# EasyEDA Pro project SquimeVR-V3S.epro

# Schematic Schematic-Tracker-v3-S
Create Date: 2024-03-23; Page Name: P1; Project Name: SquimeVR-V3S; Schematic Name: Schematic-Tracker-v3-S; Update Date: 2024-03-23; Company: 嘉立创EDA; Page Size: A4; Version: V1.0
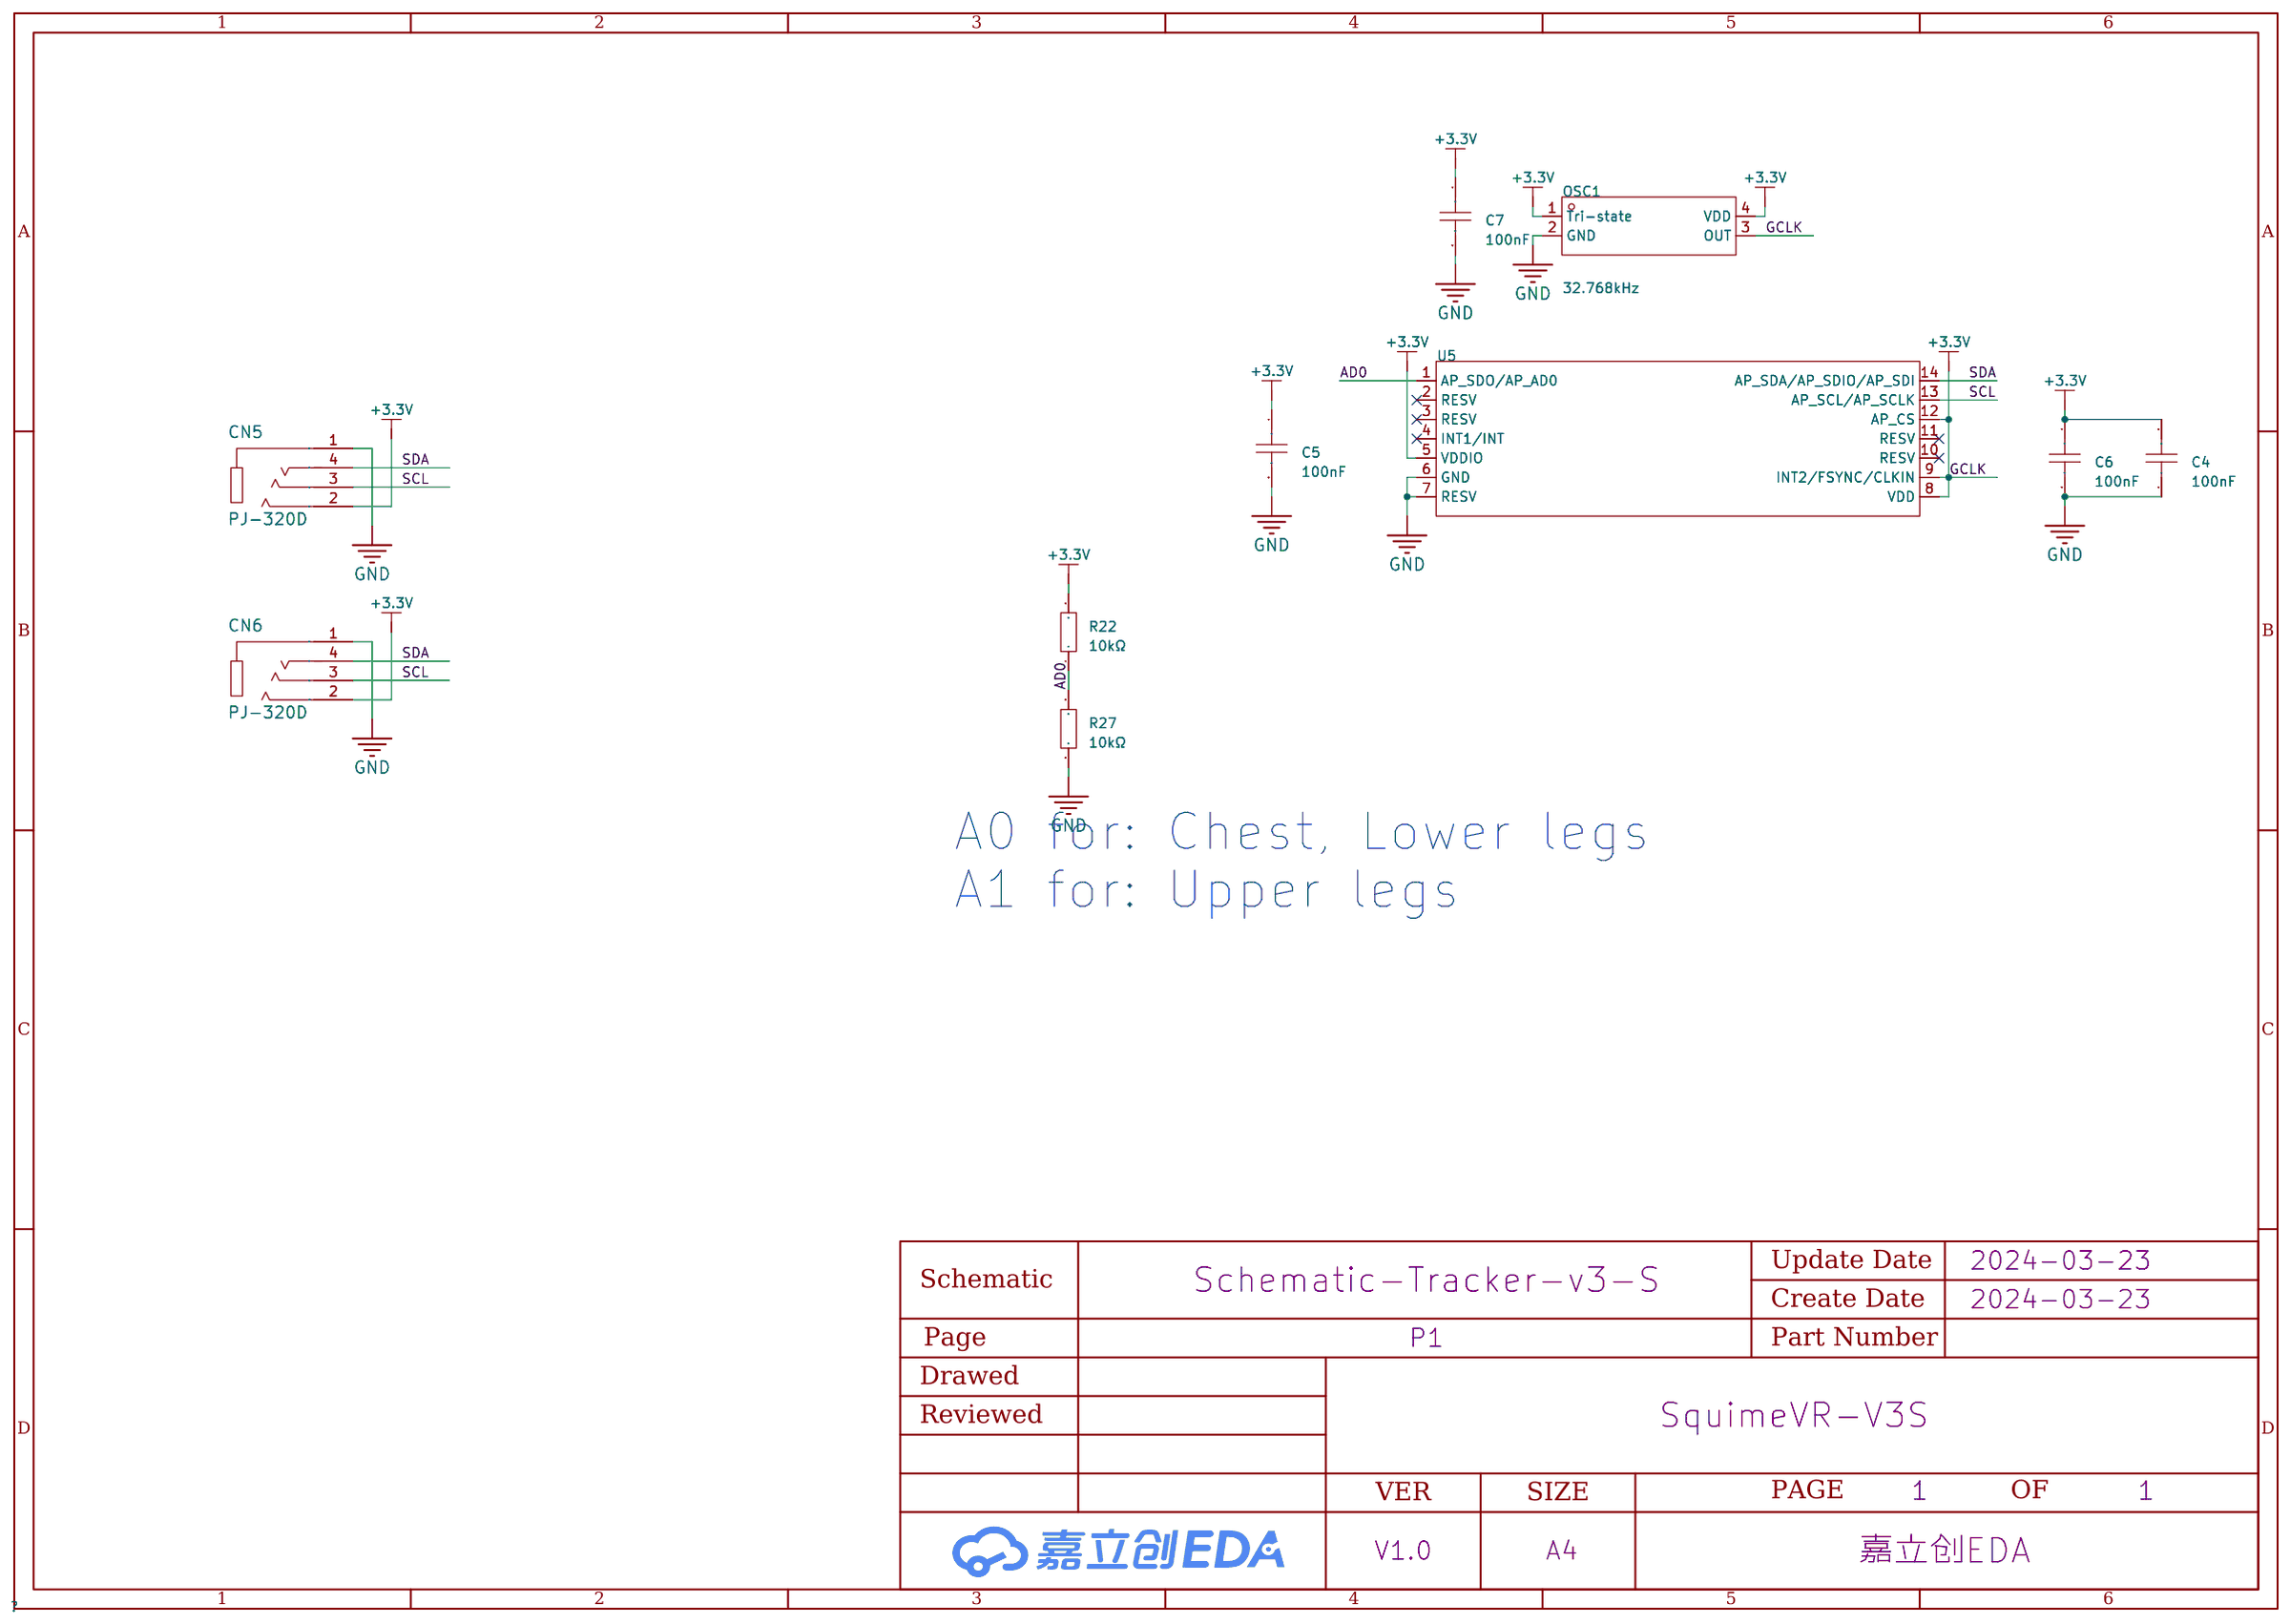
[diagram p0: schematic sheet]

## Parts
C4  100nF  [C0603]
C5  100nF  [C0603]
C6  100nF  [C0603]
C7  100nF  [C0603]
CN5  PJ-320D  [AUDIO-SMD_PJ-320D]
CN6  PJ-320D  [AUDIO-SMD_PJ-320D]
OSC1  32.768kHz  [OSC-SMD_4P-L3.2-W2.5-BL]
R22  10kΩ  [R0603]
R27  10kΩ  [R0603]
U5  ICM-42688-P  [LGA-14_L3.0-W2.5-P0.50-TL]

## Library data of the parts
C4-C7 = CC0603KRX7R9BB104: 容值:100nF;精度:±10%;额定电压:50V;材质(温度系数):X7R;; LCSC Part Name: 100nF ±10% 50V; Supplier Part: C14663; Manufacturer: YAGEO(国巨); Supplier Footprint: 0603; JLCPCB Part Class: Basic Part; Datasheet: https://atta.szlcsc.com/upload/public/pdf/source/20180910/C282072_33301C7F631E79921B82A8DAC6BCC5B3.pdf; Supplier: LCSC; Tolerance: ±10%; Voltage Rated: 50V; Temperature Coefficient: X7R
CN5 CN6 = PJ-320D: Supplier: LCSC; Supplier Part: C431535; Manufacturer: SHOUHAN; JLCPCB Part Class: ExtendedPart
OSC1 = OK2EL89CJI-111YLC-32.768K: 频率:32.768kHz;常温频差:±10ppm;工作电压:1.8V~3.3V;; LCSC Part Name: 32.768KHZ 1.8V-3.3V ±10PPM YSO120TK; Supplier Part: C5280579; Manufacturer: YXC(扬兴晶振); Supplier Footprint: SMD3225-4P; JLCPCB Part Class: Extended Part; Datasheet: https://atta.szlcsc.com/upload/public/pdf/source/20221123/314DEFB66F8D0824EF78ADB5B539B6E4.pdf; Supplier: LCSC; Normal temperature Frequency Tolerance: ±10ppm; Supply Voltage: 1.8V~3.3V
R22 R27 = 0603WAF1001T5E: 电阻类型:厚膜电阻;阻值:1kΩ;精度:±1%;功率:100mW;; LCSC Part Name: 1kΩ ±1% 100mW; Supplier Part: C21190; Manufacturer: UNI-ROYAL(厚声); Supplier Footprint: 0603; JLCPCB Part Class: Basic Part; Datasheet: https://atta.szlcsc.com/upload/public/pdf/source/20200306/C422600_1E6D84923E4A46A82E41ADD87F860B5C.pdf; Supplier: LCSC; Type: 厚膜电阻; Tolerance: ±1%; Power(Watts): 100mW; Temperature Coefficient: ±100ppm/℃; Overload Voltage (Max): 75V; Operating Temperature Range: -55℃~+155℃
U5 = ICM-42688-P: 传感器类型:加速度计陀螺仪;; Supplier Part: C1850418; Manufacturer: TDK InvenSense(应美盛); Supplier Footprint: LGA-14(2.5x3); JLCPCB Part Class: 扩展库; Datasheet: https://atta.szlcsc.com/upload/public/pdf/source/20210703/CF24204867ACE5B754A2B035F23E5931.pdf; Supplier: LCSC; Sensor Type: 加速度计陀螺仪

## Nets
+3.3V: C4.2 C5.1 C6.1 C7.1 CN5.2 CN6.2 OSC1.1(Tri-state) OSC1.4(VDD) R22.2 U5.5(VDDIO) U5.8(VDD) U5.12(AP_CS)
GND: C4.1 C5.2 C6.2 C7.2 CN5.1 CN6.1 OSC1.2(GND) R27.1 U5.6(GND) U5.7(RESV)
AD0: R22.1 R27.2 U5.1(AP_SDO/AP_AD0)
GCLK: OSC1.3(OUT) U5.9(INT2/FSYNC/CLKIN)
SCL: CN5.3 CN6.3 U5.13(AP_SCL/AP_SCLK)
SDA: CN5.4 CN6.4 U5.14(AP_SDA/AP_SDIO/AP_SDI)

Not connected (* = marked no-connect by the designer): U5 2(RESV)* 3(RESV)* 4(INT1/INT)* 10(RESV)* 11(RESV)*

## Notes on the sheet
- A0 for: Chest, Lower legs
  A1 for: Upper legs

# Schematic Schematic-Core-v3-S
Create Date: 2024-03-23; Page Name: P1; Project Name: SquimeVR-V3S; Schematic Name: Schematic-Core-v3-S; Update Date: 2024-03-23; Company: 嘉立创EDA; Page Size: A4; Version: V1.0
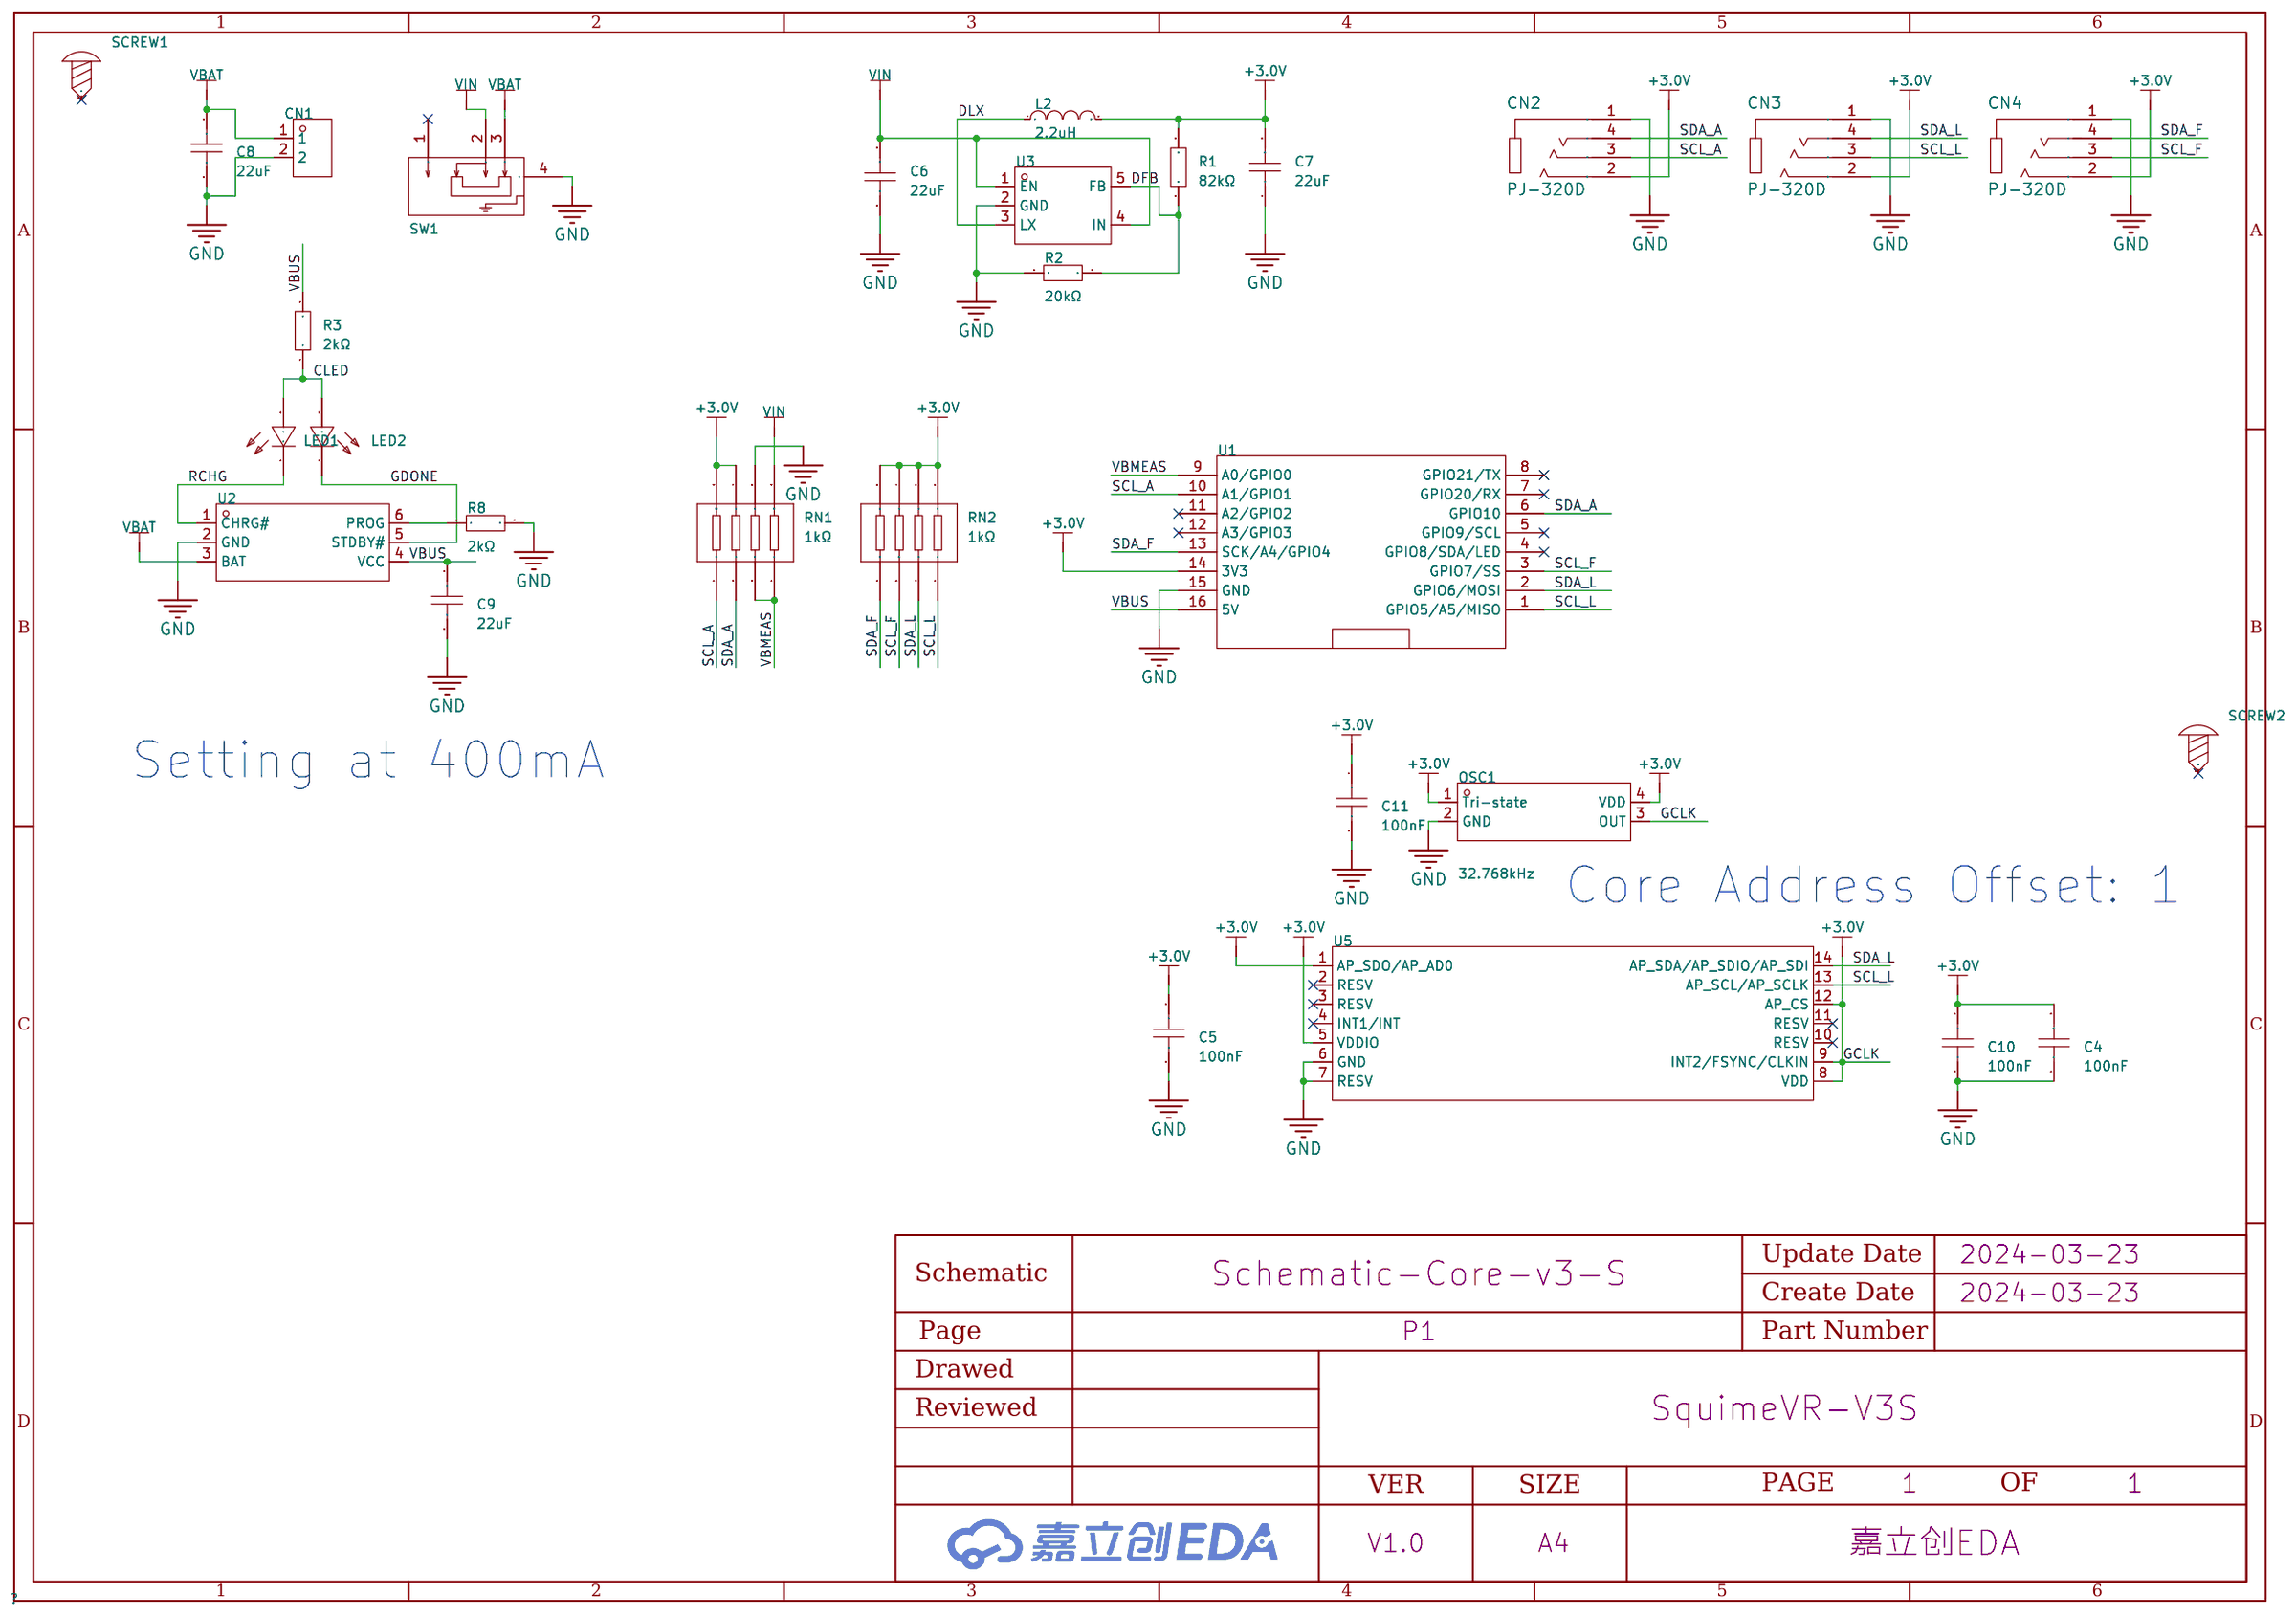
[diagram p1: schematic sheet]

## Parts
C4  100nF  [C0603]
C5  100nF  [C0603]
C6  22uF  [C0603]
C7  22uF  [C0603]
C8  22uF  [C0603]
C9  22uF  [C0603]
C10  100nF  [C0603]
C11  100nF  [C0603]
CN1  2.0-1*2P母  [HDR-TH_2P-P2.00-V-F-1]
CN2  PJ-320D  [AUDIO-SMD_PJ-320D]
CN3  PJ-320D  [AUDIO-SMD_PJ-320D]
CN4  PJ-320D  [AUDIO-SMD_PJ-320D]
L2  2.2uH  [IND-SMD_L2.5-W2.0-VLS252012CX-150M]
LED1  NCD0603R1  [LED0603-RD_RED]
LED2  NCD0603G1  [LED0603-RD]
OSC1  32.768kHz  [OSC-SMD_4P-L3.2-W2.5-BL]
R1  82kΩ  [R0603]
R2  20kΩ  [R0603]
R3  2kΩ  [R0603]
R8  2kΩ  [R0603]
RN1  1kΩ  [RES-ARRAY-SMD_0603-8P-L3.2-W1.6-BL]
RN2  1kΩ  [RES-ARRAY-SMD_0603-8P-L3.2-W1.6-BL]
SCREW1  -  [M2螺丝]
SCREW2  -  [M2螺丝]
SW1  MSK12C02  [SW-TH_MSK12C02]
U1  -  [SMD_ESP32C3SuperMini]
U2  TP4057  [SOT-23-6_L2.9-W1.6-P0.95-LS2.8-BR]
U3  M3406-ADJ  [SOT-23-5_L3.0-W1.7-P0.95-LS2.8-BR]
U5  ICM-42688-P  [LGA-14_L3.0-W2.5-P0.50-TL]

## Library data of the parts
C4 C5 C10 C11 = CC0603KRX7R9BB104: 容值:100nF;精度:±10%;额定电压:50V;材质(温度系数):X7R;; LCSC Part Name: 100nF ±10% 50V; Supplier Part: C14663; Manufacturer: YAGEO(国巨); Supplier Footprint: 0603; JLCPCB Part Class: Basic Part; Datasheet: https://atta.szlcsc.com/upload/public/pdf/source/20180910/C282072_33301C7F631E79921B82A8DAC6BCC5B3.pdf; Supplier: LCSC; Tolerance: ±10%; Voltage Rated: 50V; Temperature Coefficient: X7R
C6-C9 = CL10A226MQ8NRNC: 容值:22uF;精度:±20%;额定电压:6.3V;材质(温度系数):X5R;; LCSC Part Name: 22uF ±20% 6.3V; Supplier Part: C59461; Manufacturer: SAMSUNG(三星); Supplier Footprint: 0603; JLCPCB Part Class: Basic Part; Datasheet: https://atta.szlcsc.com/upload/public/pdf/source/20160103/1457707740762.pdf; Supplier: LCSC; Tolerance: ±20%; Voltage Rated: 6.3V; Temperature Coefficient: X5R
CN1 = 2.0-1*2P母: 间距:2mm;行距:-;安装类型:直插;排数:单排;总孔位数:2P;塑高:-;触头材质:-;触头镀层:-;; LCSC Part Name: 间距:2mm 直插; Supplier Part: C66509; Manufacturer: BOOMELE(博穆精密); Supplier Footprint: 插件,P=2mm; JLCPCB Part Class: Extended Part; Datasheet: https://atta.szlcsc.com/upload/public/pdf/source/20231221/2754FEDF6E505219A1427F9D46FAAD3C.pdf; Supplier: LCSC; Pitch: 2mm; Mounting Type: 直插; Number of Rows: 单排; Number of Holes: 2P; Pins Structure: 1x2P; Mounting Style: 直插; Reference Series: XH; Number of Pins: 2P; Number of PINs Per Row: 2; Current Rating (Max): 3A; Operating Temperature Range: -25℃~+85℃
CN2-CN4 = PJ-320D: Supplier: LCSC; Supplier Part: C431535; Manufacturer: SHOUHAN; JLCPCB Part Class: ExtendedPart
L2 = FXLB252012-2R2-M: 电感值:2.2uH;精度:±20%;额定电流:3A;饱和电流(Isat):3.3A;类型:一体成型电感;; LCSC Part Name: 2.2uH ±20% 3.3A; Supplier Part: C3040393; Manufacturer: cjiang(长江微电); Supplier Footprint: SMD,2.5x2.0x1.2mm; JLCPCB Part Class: Extended Part; Datasheet: https://atta.szlcsc.com/upload/public/pdf/source/20220812/975CD70F8F8BB72DF45FA36D37878048.pdf; Supplier: LCSC; Tolerance: ±20%; Rated Current: 3A; Saturation Current (Isat): 3.3A; DC Resistance (DCR): 68mΩ; Type: 一体成型电感; Ratings: AEC-Q200
LED1 = NCD0603R1_C84263: 灯头类型:-;发光颜色:红色;正向电压(VF):1.6V~2.6V;功率:65mW;正向电流:20mA;主波长:615nm~630nm;二极管配置:独立二极管;透镜颜色:无色透明透镜;色温:-;发光强度:80mcd~220mcd;发光角度:130°;载带方式:-;工作温度:-30℃~+85℃;; Supplier Part: C84263; Manufacturer: 国星光电; Supplier Footprint: 0603; Datasheet: https://atta.szlcsc.com/upload/public/pdf/source/20200820/C84263_DABC6A75E58F576973B407FDBA283D60.pdf; Supplier: LCSC; Emitted Color: 红色; Forward Voltage (VF): 1.6V~2.6V; Power Dissipation: 65mW; Forward Current: 20mA; Dominant Wavelength: 615nm~630nm; Diode Configuration: 独立二极管; Lens Color: 无色透明透镜; Luminous Intensity: 80mcd~220mcd; Viewing Angle: 130°; Operating Temperature: -30℃~+85℃
LED2 = NCD0603G1: 发光颜色:翠绿色;正向电压(VF):2.6V~3.6V;功率:72mW;正向电流:10mA;主波长:515nm~530nm;透镜颜色:无色透明透镜;发光强度:330mcd~900mcd;发光角度:130°;工作温度:-30℃~+85℃;; Supplier Part: C84267; Manufacturer: 国星光电; Supplier Footprint: 0603; JLCPCB Part Class: 扩展库; Datasheet: https://atta.szlcsc.com/upload/public/pdf/source/20200820/C84267_04BA7703640BAC111D09F5EFB971FBF3.pdf; Supplier: LCSC; Emitted Color: 翠绿色; Forward Voltage (VF): 2.6V~3.6V; Power Dissipation: 72mW; Forward Current: 10mA; Dominant Wavelength: 515nm~530nm; Lens Color: 无色透明透镜; Luminous Intensity: 330mcd~900mcd; Viewing Angle: 130°; Operating Temperature: -30℃~+85℃
OSC1 = OK2EL89CJI-111YLC-32.768K: 频率:32.768kHz;常温频差:±10ppm;工作电压:1.8V~3.3V;; LCSC Part Name: 32.768KHZ 1.8V-3.3V ±10PPM YSO120TK; Supplier Part: C5280579; Manufacturer: YXC(扬兴晶振); Supplier Footprint: SMD3225-4P; JLCPCB Part Class: Extended Part; Datasheet: https://atta.szlcsc.com/upload/public/pdf/source/20221123/314DEFB66F8D0824EF78ADB5B539B6E4.pdf; Supplier: LCSC; Normal temperature Frequency Tolerance: ±10ppm; Supply Voltage: 1.8V~3.3V
R1 = 0603WAF8202T5E: 电阻类型:厚膜电阻;阻值:82kΩ;精度:±1%;功率:100mW;最大工作电压:75V;温度系数:±100ppm/℃;; LCSC Part Name: 82kΩ ±1% 100mW 厚膜电阻; Supplier Part: C23254; Manufacturer: UNI-ROYAL(厚声); Supplier Footprint: 0603; JLCPCB Part Class: Basic Part; Datasheet: https://atta.szlcsc.com/upload/public/pdf/source/20200306/C422600_1E6D84923E4A46A82E41ADD87F860B5C.pdf; Supplier: LCSC; Type: 厚膜电阻; Tolerance: ±1%; Power(Watts): 100mW; Overload Voltage (Max): 75V; Temperature Coefficient: ±100ppm/℃; Operating Temperature Range: -55℃~+155℃
R2 = 0603WAF2002T5E: 电阻类型:厚膜电阻;阻值:20kΩ;精度:±1%;功率:100mW;最大工作电压:75V;温度系数:±100ppm/℃;; LCSC Part Name: 20kΩ ±1% 100mW 厚膜电阻; Supplier Part: C4184; Manufacturer: UNI-ROYAL(厚声); Supplier Footprint: 0603; JLCPCB Part Class: Basic Part; Datasheet: https://atta.szlcsc.com/upload/public/pdf/source/20200306/C422600_1E6D84923E4A46A82E41ADD87F860B5C.pdf; Supplier: LCSC; Type: 厚膜电阻; Tolerance: ±1%; Power(Watts): 100mW; Temperature Coefficient: ±100ppm/℃; Overload Voltage (Max): 75V; Operating Temperature Range: -55℃~+155℃
R3 R8 = 0603WAF2001T5E: 电阻类型:厚膜电阻;阻值:2kΩ;精度:±1%;功率:100mW;最大工作电压:75V;温度系数:±100ppm/℃;; LCSC Part Name: 2kΩ ±1% 100mW 厚膜电阻; Supplier Part: C22975; Manufacturer: UNI-ROYAL(厚声); Supplier Footprint: 0603; JLCPCB Part Class: 基础库; Datasheet: https://atta.szlcsc.com/upload/public/pdf/source/20200306/C422600_1E6D84923E4A46A82E41ADD87F860B5C.pdf; Supplier: LCSC; Type: 厚膜电阻; Tolerance: ±1%; Power(Watts): 100mW; Overload Voltage (Max): 75V; Temperature Coefficient: ±100ppm/℃; Operating Temperature Range: -55℃~+155℃
RN1 RN2 = 4D03WGJ0102T5E: 电阻器数:4;阻值:1kΩ;精度:±5%;单个元件功率:62.5mW;温度系数:±200ppm/℃;; LCSC Part Name: 1kΩ ±5%; Supplier Part: C20197; Manufacturer: UNI-ROYAL(厚声); Supplier Footprint: 0603x4; JLCPCB Part Class: Basic Part; Datasheet: https://atta.szlcsc.com/upload/public/pdf/source/20191224/C474318_2527498AE30E813171187CCD28401A71.pdf; Supplier: LCSC; Number of Resistors: 4; Tolerance: ±5%; Power(Watts): 62.5mW; Temperature Coefficient: ±200ppm/℃; Number of Pins: 8
SCREW1 SCREW2 = M2螺丝: Supplier Footprint: 插件
SW1 = MSK12C02: 电路结构:单刀双掷;安装方式:卧贴;开关颜色:-;额定电流(DC):50mA;额定电压(DC):12V;额定电流(AC):-;额定电压(AC):-;机械寿命:1万次;; LCSC Part Name: 两档侧拨贴片 7脚 滑动开关; Supplier Part: C431540; Manufacturer: SHOU HAN(首韩); Supplier Footprint: SMD; JLCPCB Part Class: Extended Part; Datasheet: https://atta.szlcsc.com/upload/public/pdf/source/20190925/C431540_89155AEF0758B9AD1B2D805F83FB12E3.pdf; Supplier: LCSC; Circuit: 单刀双掷; Pin Style: SMD接片; Switch Length: 8mm; Switch Width: 2.8mm; Switch Height: 1.4mm; Mounting Style: 卧贴; Current Rating (DC): 50mA; Voltage Rating (DC): 12V; Mechanical Life: 1万次; Operating Temperature: -20℃~+70℃
U1 = ESP32C3SuperMini: ESP32C3SuperMini迷你开发板; 尺寸: 22.52x18mm; Comment: https://www.nologo.tech/product/esp32/esp32c3SuperMini/esp32C3SuperMini.html
U2 = TP4057: 电源电压:6.5V;最大充电电流:500mA;电池类型:锂离子/聚合物;电池节数:1;; Supplier Part: C725791; Manufacturer: UMW(友台半导体); Supplier Footprint: SOT-23-6; JLCPCB Part Class: 扩展库; Datasheet: https://atta.szlcsc.com/upload/public/pdf/source/20231109/7FB39B0490CD1514A6792371FCA0BB30.pdf; Supplier: LCSC; Supply Voltage: 6.5V; Maximum Charge Current: 500mA; Type of Battery: 锂离子/聚合物; Number of Cells: 1; Operating Temperature: -40℃~+85℃
U3 = M3406-ADJ: 功能类型:降压型;输入电压:-;输出电流(最大值):-;; Supplier Part: C83224; Manufacturer: 西安航天民芯; Supplier Footprint: SOT-23-5; JLCPCB Part Class: Extended Part; Datasheet: https://atta.szlcsc.com/upload/public/pdf/source/20180301/C181743_15198944852831384030.pdf; Supplier: LCSC; Function: 降压型; Switch tube (built-in/external): 内置
U5 = ICM-42688-P: 传感器类型:加速度计陀螺仪;; Supplier Part: C1850418; Manufacturer: TDK InvenSense(应美盛); Supplier Footprint: LGA-14(2.5x3); JLCPCB Part Class: 扩展库; Datasheet: https://atta.szlcsc.com/upload/public/pdf/source/20210703/CF24204867ACE5B754A2B035F23E5931.pdf; Supplier: LCSC; Sensor Type: 加速度计陀螺仪

## Nets
+3.0V: C4.2 C5.1 C7.2 C10.1 C11.1 CN2.2 CN3.2 CN4.2 L2.2 OSC1.1(Tri-state) OSC1.4(VDD) R1.2 RN1.7 RN1.8 RN2.5 RN2.6 RN2.7 RN2.8 U1.14(3V3) U5.1(AP_SDO/AP_AD0) U5.5(VDDIO) U5.8(VDD) U5.12(AP_CS)
GND: C4.1 C5.2 C6.1 C7.1 C8.2 C9.2 C10.2 C11.2 CN1.2 CN2.1 CN3.1 CN4.1 OSC1.2(GND) R2.1 R8.1 RN1.6 SW1.4 U1.15(GND) U2.2(GND) U3.2(GND) U5.6(GND) U5.7(RESV)
VBAT: C8.1 CN1.1 SW1.3 U2.3(BAT)
VBUS: C9.1 R3.2 U1.16(5V) U2.4(VCC)
VIN: C6.2 RN1.5 SW1.2 U3.1(EN) U3.4(IN)
CLED: LED1.2(A) LED2.2(A) R3.1
DFB: R1.1 R2.2 U3.5(FB)
DLX: L2.1 U3.3(LX)
GCLK: OSC1.3(OUT) U5.9(INT2/FSYNC/CLKIN)
GDONE: LED2.1(K) U2.5(STDBY#)
RCHG: LED1.1(K) U2.1(CHRG#)
SCL_A: CN2.3 RN1.1 U1.10(A1/GPIO1)
SCL_F: CN4.3 RN2.2 U1.3(GPIO7/SS)
SCL_L: CN3.3 RN2.4 U1.1(GPIO5/A5/MISO) U5.13(AP_SCL/AP_SCLK)
SDA_A: CN2.4 RN1.2 U1.6(GPIO10)
SDA_F: CN4.4 RN2.1 U1.13(SCK/A4/GPIO4)
SDA_L: CN3.4 RN2.3 U1.2(GPIO6/MOSI) U5.14(AP_SDA/AP_SDIO/AP_SDI)
VBMEAS: RN1.3 RN1.4 U1.9(A0/GPIO0)
$1N26747: R8.2 U2.6(PROG)

Not connected (* = marked no-connect by the designer): SCREW1 1*; SCREW2 1*; SW1 1*; U1 4(GPIO8/SDA/LED)* 5(GPIO9/SCL)* 7(GPIO20/RX)* 8(GPIO21/TX)* 11(A2/GPIO2)* 12(A3/GPIO3)*; U5 2(RESV)* 3(RESV)* 4(INT1/INT)* 10(RESV)* 11(RESV)*

## Notes on the sheet
- Setting at 400mA
- Core Address Offset: 1

# Board PCB-Core-v3-S
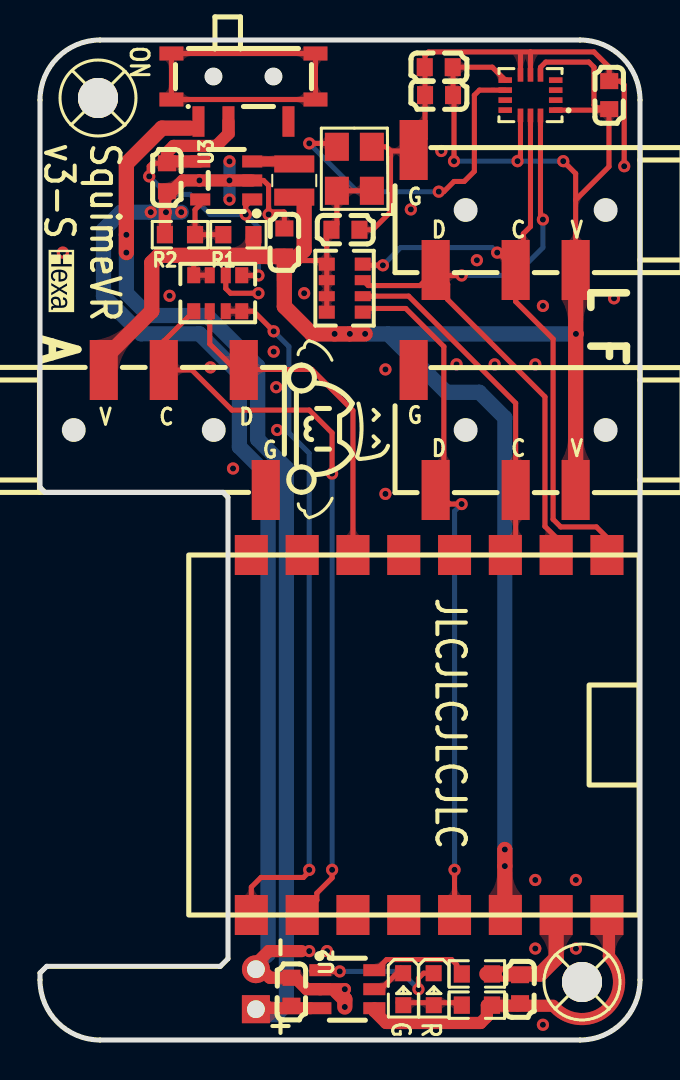
[diagram p2: board, top side]
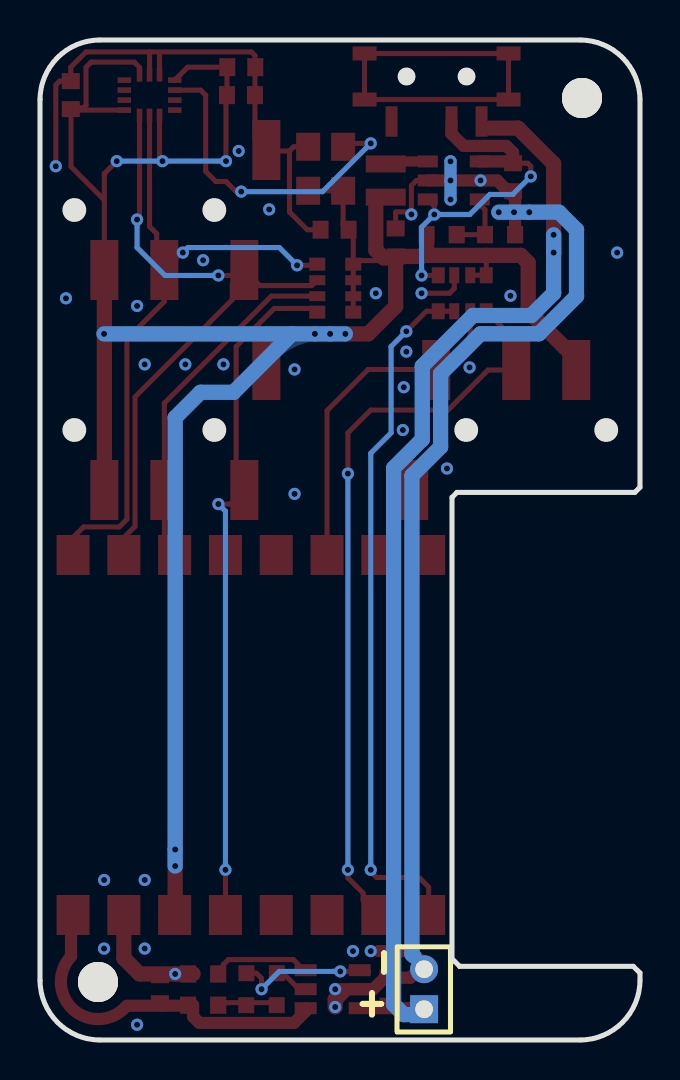
[diagram p3: board, bottom side, seen from below]

Outline 30 x 50 mm; copper layers: Top Layer, Bottom Layer. Coordinates in mm from the lower left corner of the outline.
Outline path: 0,47 0,27.64 0.26,27.38 9.15,27.38 9.4,27.13 9.4,4.06 9.02,3.68 0.34,3.68 0,3.35 0,3 arc(0.88,0.88) 3,0 27,0 arc(29.12,0.88) 30,3 30,47 arc(29.12,49.12) 27,50 3,50 arc(0.88,49.12) 0,47
Stack: Top Layer 0.035mm / Dielectric1 1.51mm FR4 er 4.5 / Bottom Layer 0.035mm

## Design rules (mm)
template: 自定义配置
spacing copperThickness1oz (default): track to track 0.152, other pairs 0.152 to 0.3
spacing copperThickness2oz: track to track 0.203, other pairs 0.152 to 0.3
track width copperThickness1oz (default): min 0.127, default 0.254, max 2.54
track width copperThickness2oz: min 0.203, default 0.254, max 2.54
differential pair differentialPair (default): width min 0.127, default 0.254, max 2.54; gap min 0.152, default 0.152
via viaSize (default): diameter min 0.5, default 0.61, max 10; hole min 0.3, default 0.305, max 6.299
pour e2900 uses copperRegion

## Placement (name value [footprint] x y rotation side)
C4  100nF  [C0603]  19.95 47.24 0 top
C5  100nF  [C0603]  28.46 47.24 90 top
C6  22uF  [C0603]  6.35 43.14 90 top
C7  22uF  [C0603]  12.22 39.88 270 top
C8  22uF  [C0603]  12.57 2.41 90 top
C9  22uF  [C0603]  24 2.54 90 top
C10  100nF  [C0603]  19.94 48.64 180 top
C11  100nF  [C0603]  15.27 40.51 0 top
CN1  2.0-1*2P母  [HDR-TH_2P-P2.00-V-F-1]  10.79 2.54 90 bottom
CN2  PJ-320D  [AUDIO-SMD_PJ-320D]  7.24 30.5 90 top
CN3  PJ-320D  [AUDIO-SMD_PJ-320D]  22.73 41.5 270 top
CN4  PJ-320D  [AUDIO-SMD_PJ-320D]  22.73 30.5 270 top
L2  2.2uH  [IND-SMD_L2.5-W2.0-VLS252012CX-150M]  12.71 42.97 270 top
LED1  NCD0603R1  [LED0603-RD_RED]  19.69 2.54 270 top
LED2  NCD0603G1  [LED0603-RD]  18.16 2.54 270 top
OSC1  32.768kHz  [OSC-SMD_4P-L3.2-W2.5-BL]  15.72 43.56 90 top
R1  82kΩ  [R0603]  9.92 40.27 0 top
R2  20kΩ  [R0603]  7 40.27 0 top
R3  2kΩ  [R0603]  21.84 1.74 0 top
R8  2kΩ  [R0603]  21.84 3.3 180 top
RN1  1kΩ  [RES-ARRAY-SMD_0603-8P-L3.2-W1.6-BL]  8.89 37.34 0 top
RN2  1kΩ  [RES-ARRAY-SMD_0603-8P-L3.2-W1.6-BL]  15.24 37.59 90 top
SCREW1  -  [M2螺丝]  27.1 2.9 0 top
SCREW2  -  [M2螺丝]  2.9 47.1 0 top
SW1  MSK12C02  [SW-TH_MSK12C02]  10.17 47.62 180 top
U1  -  [SMD_ESP32C3SuperMini]  19.46 15.25 270 top
U2  TP4057  [SOT-23-6_L2.9-W1.6-P0.95-LS2.8-BR]  15.37 2.54 180 top
U3  M3406-ADJ  [SOT-23-5_L3.0-W1.7-P0.95-LS2.8-BR]  9.31 42.98 0 top
U5  ICM-42688-P  [LGA-14_L3.0-W2.5-P0.50-TL]  24.52 47.24 180 top

## Footprints (pads in the part's own frame, mm; a bottom-side part is the same pattern mirrored in y, then rotated)
AUDIO-SMD_PJ-320D
  rect 3x1.4 smd: 1(-3,-4.05) 2(3,4.05) 3(3,1.05) 4(3,-2.95)
C0603
  rect 0.8x0.9 smd: 1(-0.7,0) 2(0.7,0)
HDR-TH_2P-P2.00-V-F-1
  rect 1.4x1.4 hole 0.889: 1(-1,0)
  round 1.4 hole 0.889: 2(1,0)
IND-SMD_L2.5-W2.0-VLS252012CX-150M
  rect 0.85x2 smd: 1(-0.83,0) 2(0.83,0)
LED0603-RD
  rect 0.8x0.8 smd: 1(-0.799,-0.004) 2(0.799,0.004)
LED0603-RD_RED
  rect 0.8x0.8 smd: 1(-0.799,-0.004) 2(0.799,0.004)
LGA-14_L3.0-W2.5-P0.50-TL
  rect 0.675x0.28 smd: 1(-1.262,0.75) 2(-1.262,0.25) 3(-1.262,-0.25) 4(-1.262,-0.75) 8(1.262,-0.75) 9(1.262,-0.25) 10(1.262,0.25) 11(1.262,0.75)
  rect 0.28x0.675 smd: 5(-0.5,-1.012) 6(0,-1.012) 7(0.5,-1.012) 12(0.5,1.012) 13(0,1.012) 14(-0.5,1.012)
M2螺丝
  round 2 hole 2: 1(0,0)
OSC-SMD_4P-L3.2-W2.5-BL
  rect 1.4x1.2 smd: 1(-1.1,-0.875) 2(1.1,-0.875) 3(1.1,0.875) 4(-1.1,0.875)
R0603
  rect 0.806x0.864 smd: 1(-0.753,0) 2(0.753,0)
RES-ARRAY-SMD_0603-8P-L3.2-W1.6-BL
  rect 0.65x0.8 smd: 1(-1.2,-0.9) 4(1.2,-0.9) 5(1.2,0.9) 8(-1.2,0.9)
  rect 0.5x0.8 smd: 2(-0.4,-0.9) 3(0.4,-0.9) 6(0.4,0.9) 7(-0.4,0.9)
SMD_ESP32C3SuperMini
  rect 2x1.651 smd: 1(-9,8.89) 2(-9,6.35) 3(-9,3.81) 4(-9,1.27) 5(-9,-1.27) 6(-9,-3.81) 7(-9,-6.35) 8(-9,-8.89) 9(9,-8.89) 10(9,-6.35) 11(9,-3.81) 12(9,-1.27) 13(9,1.27) 14(9,3.81) 15(9,6.35) 16(9,8.89)
SOT-23-5_L3.0-W1.7-P0.95-LS2.8-BR
  rect 1x0.6 smd: 1(1.3,-0.95) 2(1.3,0) 3(1.3,0.95) 4(-1.3,0.95) 5(-1.3,-0.95)
SOT-23-6_L2.9-W1.6-P0.95-LS2.8-BR
  rect 1.1x0.6 smd: 1(1.35,-0.95) 2(1.35,0) 3(1.35,0.95) 4(-1.35,0.95) 5(-1.35,0) 6(-1.35,-0.95)
SW-TH_MSK12C02
  rect 0.6x1.524 smd: 1(-2.25,1.7) 2(0.75,1.7) 3(2.25,1.7)
  rect 1.2x0.7 smd: 4(-3.6,0.6) 4(-3.6,-1.7) 4(3.6,0.6) 4(3.6,-1.7)

## Nets
As in the schematic.

Pads without a net: SCREW1 1; SCREW2 1; SW1 1; U1 4 5 7 8 11 12; U5 2 3 4 10 11

## Via types
v1: diameter 0.61, hole 0.305, Top Layer to Bottom Layer, 66 vias

## Routing (per net, layer and track width the routed paths; a pad name or vN(x,y) marks a point on that pad's centre or on a via; arc(x,y) is an arc through that point)
+3.0V: length 128.7
  Top Layer w0.254: 7.66,39.23 7.69,39.2 RN1.8 RN1.7 ; 23.35,47.99 U5.8 22.62,48.64 C10.1 20.65,48.63 20.65,46.99 20.7,46.94 v1(20.7,43.94) ; v1(26.16,43.94) 26.78,43.32 26.78,42 ; 26.78,42 26.78,38.4 ; 26.78,42 28.45,43.67 28.45,46.34 28.29,46.49 ; 28.18,46.61 27.83,46.61 27.7,46.74 27.7,48.64 27.44,48.89 25.29,48.89 25.02,48.63 25.02,48.16 ; 28.18,46.61 28.29,46.49 ; 28.18,46.61 28.4,46.61 C5.1 ; v1(23.88,43.94) 24.02,43.94 U5.12 ; C11.1 14.84,40.79 14.84,42.46 16.59,42.46 ; C7.2 12.43,38.97 14.34,38.97 ; 28.29,46.49 25.69,46.49 ; 14.34,38.97 RN2.7 RN2.8 ; 14.34,38.97 14.34,40.32
  Top Layer w0.762: 10.89,39.23 5.96,39.23 5.59,38.86 5.59,36.45 3.19,34.05 CN2.2 ; 10.89,39.23 10.67,39.45 R1.2 ; 10.89,39.23 10.95,39.18 C7.2 12.22,39.1 ; 12.22,39.1 12.81,39.1 13.21,39.5 13.21,41.9 13.09,42.02 ; 12.22,39.1 12.22,36.68 13.59,35.31 v1(14.73,35.31) v1(15.49,35.31) v1(16.26,35.31) ; 26.78,27.6 26.78,35.29 v1(26.8,35.31) 26.78,35.32 26.78,38.4 ; 23.27,6.11 23.24,6.14 v1(23.24,8.7) v1(23.24,9.53)
  Bottom Layer w0.254: v1(20.7,43.94) v1(23.88,43.94) v1(26.16,43.94)
  Bottom Layer w0.762: v1(26.8,35.31) 17.4,35.31 ; 17.4,35.31 20.32,32.39 21.97,32.39 23.24,31.11 v1(23.24,9.53) v1(23.24,8.7) ; 17.4,35.31 v1(16.26,35.31) v1(15.49,35.31) v1(14.73,35.31)
GND: length 123.3
  Top Layer w0.254: 24.52,48.16 24.52,49.4 ; 24.52,49.4 27.7,49.4 28.46,48.64 C5.2 29.02,47.94 29.21,47.75 v1(29.21,43.69) 29.34,43.56 ; 24.52,49.4 19.43,49.4 19.25,49.22 19.25,45.07 CN3.1 18.63,44.45 17.53,44.45 ; 16.72,44.66 17.31,44.66 17.53,44.45 ; v1(10.92,37.34) 9.53,37.34 9.29,37.58 RN1.6 ; 17.53,44.45 17.53,41.4 16.64,40.51 15.97,40.51 ; C7.1 12.22,41.38 12.19,41.41 11.55,41.41 11.43,41.53 11.43,42.72 11.18,42.98 U3.2 ; 24.02,48.16 24.02,49.37 ; 6.57,49.33 SW1.4 SW1.4 6.57,47.03 6.57,49.33
  Top Layer w0.61: v1(15.24,2.54) U2.2 13.34,2.54 12.76,3.11 C8.2 11.49,3.11 10.79,3.81 11.43,4.44 13.08,4.44 ; U3.2 v1(9.47,42.98) v1(7.97,42.98) 7.14,42.98 6.25,42.08 R2.1
  Top Layer w0.762: 14.86,2.41 15.24,2.03 v1(15.24,1.65) ; 22.34,3.3 v1(23.24,3.3) 25.02,3.3 25.81,4.09 25.81,5.99
  Bottom Layer w0.61: v1(9.47,42.03) v1(9.47,42.98) v1(9.47,43.93)
  Bottom Layer w0.762: 11.3,4.19 11.4,4.29 11.4,28.22 9.97,29.65 9.97,33.31 7.97,35.31 5.05,35.31 3.18,37.19 3.18,40.51 4.05,41.39 v1(5.54,41.39) v1(6.3,41.39) v1(7.06,41.39)
  vias: v1(1.14,39.37) v1(6.48,37.21) v1(8.52,33.63) v1(9.65,28.58) v1(11.43,41.28) v1(11.68,34.42) v1(11.81,32.64) v1(11.86,30.5) v1(13.21,37.34) v1(13.46,4.44) v1(14.35,4.44) v1(17.27,33.53) v1(17.27,27.31) v1(18.54,41.53) v1(20.07,44.45) v1(20.83,33.78) v1(21.84,38.99) v1(22.73,33.78) v1(24.76,33.78) v1(24.76,8) v1(24.76,4.57) v1(25.15,36.7) v1(25.15,0.76) v1(26.79,8) v1(26.8,4.57) v1(28.7,37.08)
VBAT: length 57.4
  Top Layer w0.61: 13.51,1.59 10.72,1.59 10.56,1.75 11.27,1.75 11.3,1.71
  Top Layer w0.762: v1(4.32,39.37) v1(4.32,40.26) 4.32,43.81 6.1,45.59 7.49,45.59
  Bottom Layer w0.762: 10.79,1.27 11.81,1.27 12.32,1.78 12.32,28.6 10.88,30.03 10.88,33.69 8.35,36.23 5.43,36.23 4.32,37.34 v1(4.32,39.37) v1(4.32,40.26)
VBUS: length 17.7
  Top Layer w0.61: 28.44,4.19 arc(28.38,1.55) 25.75,1.62 ; 25.65,1.71 22.37,1.71 22.34,1.74 22.34,1.17 22.03,0.85 17.3,0.85 16.72,1.44 U2.4 ; 28.45,4.19 28.45,5.9 28.35,6
VIN: length 18.4
  Top Layer w0.254: v1(5.46,43.18) 5.46,43.69 5.61,43.84 C6.2 ; U3.1 10.29,41.7 v1(10.29,41.28) ; v1(10.92,38.23) 10.1,38.23 RN1.5
  Top Layer w0.61: U3.4 6.35,43.93 ; 6.35,43.93 C6.2 ; 6.35,43.93 6.35,44.37 6.68,44.7 8.81,44.7 9.42,45.31 SW1.2
  Bottom Layer w0.254: v1(5.46,43.18) 6.36,42.28 7.5,42.28 8.51,41.28 v1(10.29,41.28) 10.92,40.64 v1(10.92,38.23)
CLED: length 3
  Top Layer w0.254: 20.84,1.74 20.71,1.87 17.91,1.87
DFB: length 3.5
  Top Layer w0.254: 9.29,40.27 R2.2 7.75,41.51 8.26,42.03
DLX: length 1.9
  Top Layer w0.508: L2.1 12.59,43.93 10.86,43.93
GCLK: length 16.7
  Top Layer w0.254: v1(19.94,42.42) 20.19,42.42 20.7,42.93 21.21,42.93 21.72,43.43 21.72,47.24 21.97,47.49 U5.9 ; 14.97,44.66 14.8,44.83 v1(13.46,44.83)
  Bottom Layer w0.254: v1(13.46,44.83) 15.88,42.42 v1(19.94,42.42)
GDONE: length 1.7
  Top Layer w0.254: 16.92,2.41 18.04,3.54 18.04,3.61
RCHG: length 7.1
  Top Layer w0.254: LED1.1 19.18,3.34 18.92,3.08 v1(18.92,2.54) ; v1(14.99,3.43) 13.57,3.43
  Bottom Layer w0.254: v1(18.92,2.54) 18.03,3.43 v1(14.99,3.43)
SCL_A: length 37.6
  Top Layer w0.254: U1.10 13.84,6.99 13.84,7.34 14.6,8.11 v1(14.6,8.51) ; v1(14.6,28.32) 14.6,30.35 13.46,31.5 9.6,31.5 7.59,33.5 CN2.3 6.19,34.94 7.4,36.15
  Bottom Layer w0.254: v1(14.6,8.51) v1(14.6,28.32)
SCL_F: length 17.8
  Top Layer w0.254: 23.27,24.11 23.78,24.63 CN4.3 23.78,31.84 18.43,37.19 RN2.2
SCL_L: length 34
  Top Layer w0.254: v1(17.15,38.73) 16.19,38.73 RN2.4 ; 28.35,24.11 28.35,25.13 27.82,25.65 26.03,25.65 25.65,26.03 25.65,35.05 23.78,36.92 CN3.3 ; CN3.3 24.17,38.88 24.17,40.32 24.52,40.67 24.52,46.32 ; CN3.3 22.91,39.37 v1(22.86,39.37)
  Bottom Layer w0.254: v1(22.86,39.37) 22.61,39.62 18.03,39.62 v1(17.15,38.73)
SDA_A: length 17.6
  Top Layer w0.254: 15.65,24.11 15.65,31.47 13.59,33.53 10.22,33.53 CN2.4 9.79,33.5 8.49,34.8 RN1.2
SDA_F: length 34.5
  Top Layer w0.254: 19.78,27.61 19.78,27.6 20.19,28.01 20.19,34.67 18.29,36.58 16.32,36.58 RN2.1 ; U1.13 v1(20.73,8.51) ; v1(21.08,26.8) 20.49,26.8 CN4.4
  Bottom Layer w0.254: v1(20.73,8.51) 20.73,26.44 v1(21.08,26.8)
SDA_L: length 33.4
  Top Layer w0.254: RN2.3 16.41,37.72 19,37.72 CN3.4 19.78,38.38 20.39,37.78 20.39,37.02 25.25,32.16 25.25,25.68 25.81,25.12 25.81,24.11 ; v1(21.08,38.23) 20.06,38.23 ; 25.02,46.32 25.02,41.14 v1(25.15,41.02)
  Bottom Layer w0.254: v1(21.08,38.23) 23.75,38.23 25.15,39.62 v1(25.15,41.02)
VBMEAS: length 35.3
  Top Layer w0.254: RN1.3 RN1.4 10.68,36.44 v1(11.68,35.43) ; v1(13.46,8.51) 13.46,8.42 13.17,8.13 11.05,8.13 10.57,7.65 10.57,6.11
  Bottom Layer w0.254: v1(13.46,8.51) 13.46,29.34 12.45,30.35 12.45,34.67 v1(11.68,35.43)
$1N26747: length 5.3
  Top Layer w0.254: 21.09,3.05 20.84,3.3 20.84,3.77 20.58,4.02 17.33,4.02 16.8,3.49 U2.6

## Copper pours and planes (outline as drawn; the poured copper is in the pictures)
GND on Top Layer: -5.56,52.09 47.15,52.09 47.15,-9.13 -5.56,-9.13
GND on Bottom Layer: -3.4,-1 45.11,-1 45.11,61.11 -3.4,61.11

Small or netless copper shapes (teardrops, artwork), in the pictures only: 147 on Top Layer, 23 on Bottom Layer

## Text on the board
Bottom Silkscreen Layer: + | -
Document Layer: 803530
Top Silkscreen Layer: V | C | D | G | ON | R | - | + | SquimeVR / v3-S | JLCJLCJLCJLC | A | L | F | Hexa

# Board PCB-Tracker-v3-S
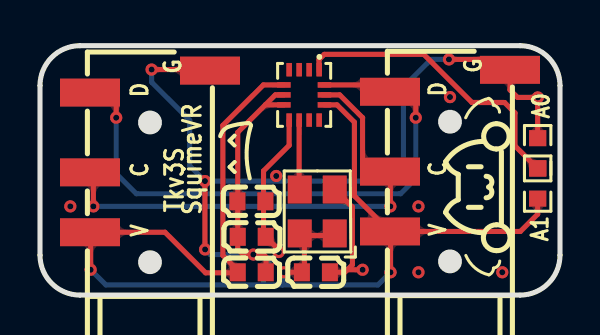
[diagram p4: board, top side]
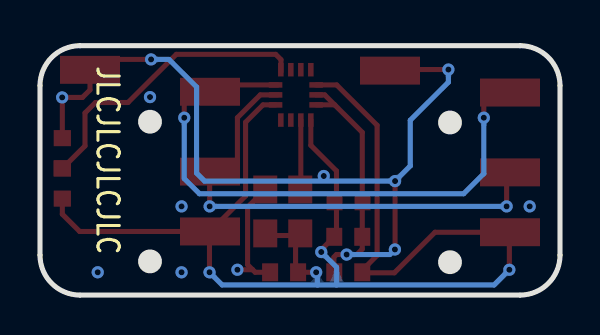
[diagram p5: board, bottom side, seen from below]

Outline 26 x 12.5 mm; copper layers: Top Layer, Bottom Layer. Coordinates in mm from the lower left corner of the outline.
Outline path: 0,10.5 0,2 arc(0.59,0.59) 2,0 24,0 arc(25.41,0.59) 26,2 26,10.5 arc(25.41,11.91) 24,12.5 2,12.5 arc(0.59,11.91) 0,10.5
Stack: Top Layer 0.035mm / Dielectric1 1.51mm FR4 er 4.5 / Bottom Layer 0.035mm

## Design rules (mm)
template: JLCPCB Capability(Two Layers Board)
spacing copperThickness1oz (default): track to track 0.102, other pairs 0.152 to 0.3
spacing copperThickness2oz: track to track 0.203, other pairs 0.152 to 0.3
track width copperThickness1oz (default): min 0.127, default 0.254, max 2.54
track width copperThickness2oz: min 0.203, default 0.254, max 2.54
differential pair differentialPair (default): width min 0.127, default 0.254, max 2.54; gap min 0.152, default 0.152
via viaSize (default): diameter min 0.5, default 0.61, max 10; hole min 0.3, default 0.305, max 6.3

## Placement (name value [footprint] x y rotation side)
C4  100nF  [C0603]  10.57 4.7 0 top
C5  100nF  [C0603]  10.59 2.92 180 top
C6  100nF  [C0603]  10.59 1.14 0 top
C7  100nF  [C0603]  13.79 1.14 0 top
CN5  PJ-320D  [AUDIO-SMD_PJ-320D]  20.5 7.24 180 top
CN6  PJ-320D  [AUDIO-SMD_PJ-320D]  5.5 7.2 180 top
OSC1  32.768kHz  [OSC-SMD_4P-L3.2-W2.5-BL]  13.86 4.19 90 top
R22  10kΩ  [R0603]  24.88 5.59 270 top
R27  10kΩ  [R0603]  24.88 7.11 270 top
U5  ICM-42688-P  [LGA-14_L3.0-W2.5-P0.50-TL]  13.21 10.03 270 top

## Footprints (pads in the part's own frame, mm; a bottom-side part is the same pattern mirrored in y, then rotated)
AUDIO-SMD_PJ-320D
  rect 3x1.4 smd: 1(-3,-4.05) 2(3,4.05) 3(3,1.05) 4(3,-2.95)
C0603
  rect 0.8x0.9 smd: 1(-0.7,0) 2(0.7,0)
LGA-14_L3.0-W2.5-P0.50-TL
  rect 0.675x0.28 smd: 1(-1.262,0.75) 2(-1.262,0.25) 3(-1.262,-0.25) 4(-1.262,-0.75) 8(1.262,-0.75) 9(1.262,-0.25) 10(1.262,0.25) 11(1.262,0.75)
  rect 0.28x0.675 smd: 5(-0.5,-1.012) 6(0,-1.012) 7(0.5,-1.012) 12(0.5,1.012) 13(0,1.012) 14(-0.5,1.012)
OSC-SMD_4P-L3.2-W2.5-BL
  rect 1.4x1.2 smd: 1(-1.1,-0.875) 2(1.1,-0.875) 3(1.1,0.875) 4(-1.1,0.875)
R0603
  rect 0.806x0.864 smd: 1(-0.753,0) 2(0.753,0)

## Nets
As in the schematic.

Pads without a net: U5 2 3 4 10 11

## Via types
v1: diameter 0.61, hole 0.305, Top Layer to Bottom Layer, 21 vias

## Routing (per net, layer and track width the routed paths; a pad name or vN(x,y) marks a point on that pad's centre or on a via; arc(x,y) is an arc through that point)
+3.3V: length 70.7
  Top Layer w0.254: 11.41,2.92 11.18,3.16 11.18,6.22 12.46,7.5 U5.8 ; v1(12.19,1.14) C7.1 ; v1(2.53,1.27) 2.53,3.12 CN6.2 6.25,3.15 8.28,1.12 10.01,1.12 9.14,1.99 9.14,8.51 11.17,10.53 U5.5 ; v1(11.94,2.16) 11.94,2.27 11.29,2.92 ; 14.86,3.09 14.76,2.98 13.22,2.98 13.22,1.14 ; CN5.2 24.02,3.19 24.88,4.06 R22.2 ; CN5.2 17.53,3.16 v1(17.53,1.14) ; CN5.2 15.72,4.97 15.72,8.66 14.85,9.53 U5.12
  Bottom Layer w0.254: v1(17.53,1.14) 16.89,0.51 12.13,0.51 ; v1(2.53,1.27) 3.29,0.51 11.17,0.51 ; v1(12.19,1.14) 12.13,1.08 12.13,0.51 ; 11.17,0.51 11.17,1.39 v1(11.94,2.16) ; 11.17,0.51 12.13,0.51
GND: length 59.5
  Top Layer w0.254: v1(5.58,11.3) 8.62,11.3 8.67,11.25 ; 9.89,4.68 C5.2 9.89,2.31 10.16,2.03 v1(10.67,2.03) 11.18,2.03 11.3,1.91 11.3,1.16 11.29,1.14 ; 9.89,4.68 C4.1 ; 9.89,4.68 9.89,8.16 11.26,9.53 ; 23.69,11.29 23.17,11.81 v1(20.45,11.81) ; 15.37,1.27 15.24,1.14 C7.2 ; 15.37,1.27 v1(16.13,1.27) ; 15.37,1.27 15.62,1.52 15.62,4.41 OSC1.2 ; 11.26,9.53 11.76,10.03 U5.6 ; 11.26,9.53 U5.7 ; CN5.1 23.5,10.28 23.88,9.91 v1(24.89,9.91) 24.88,9.9 R27.1 ; v1(8.25,2.29) 8.25,2.29 v1(8.25,5.72)
  Bottom Layer w0.254: v1(5.58,11.3) 5.58,10.67 7.49,8.76 7.49,6.48 v1(8.25,5.72) 17.77,5.72 18.17,6.11 18.17,10.43 19.55,11.81 v1(20.45,11.81) ; v1(8.25,2.29) 8.51,2.03 v1(10.67,2.03)
  vias: v1(1.52,4.44) v1(11.81,5.97) v1(18.92,4.44) v1(18.92,1.14) v1(20.5,9.92) v1(23.11,1.14)
AD0: length 15
  Top Layer w0.254: 13.95,11.2 13.95,11.8 14.22,12.06 19.19,12.06 21.6,9.65 23.23,9.65 23.75,9.13 23.75,7.48 R22.1
GCLK: length 3.5
  Top Layer w0.254: U5.9 12.96,5.45 13.11,5.29
SCL: length 24.9
  Top Layer w0.254: CN5.3 16.54,6.19 16.13,6.6 16.13,8.89 14.99,10.03 14.12,10.03 ; 17.5,6.22 17.66,6.22 17.69,6.19 17.52,6.01 v1(17.52,4.44) ; 2.67,6.15 v1(2.67,4.44)
  Bottom Layer w0.254: v1(2.67,4.44) v1(17.52,4.44)
SDA: length 29.5
  Top Layer w0.254: 14.12,10.53 17.35,10.53 17.69,10.19 18.25,10.19 18.79,9.65 v1(18.79,8.89) ; v1(3.81,8.89) 3.81,9.64 3.3,10.15 2.67,10.15
  Bottom Layer w0.254: v1(18.79,8.89) 18.79,5.84 18.03,5.08 4.82,5.08 3.81,6.09 v1(3.81,8.89)

## Copper pours and planes (outline as drawn; the poured copper is in the pictures)
GND on Top Layer: -0.9,29.72 34.16,29.72 34.16,-1.65 -0.9,-1.65
GND on Bottom Layer: -3.82,21.59 32.88,21.59 32.88,-13.33 -3.82,-13.33

Small or netless copper shapes (teardrops, artwork), in the pictures only: 60 on Top Layer, 16 on Bottom Layer

## Text on the board
Bottom Silkscreen Layer: JLCJLCJLCJLC
Top Silkscreen Layer: D | C | V | G | A1 | A0 | Tkv3S | SquimeVR
